# EAGLE design DUB_with_Tono(ver1.0) (EAGLE 9.6.2)
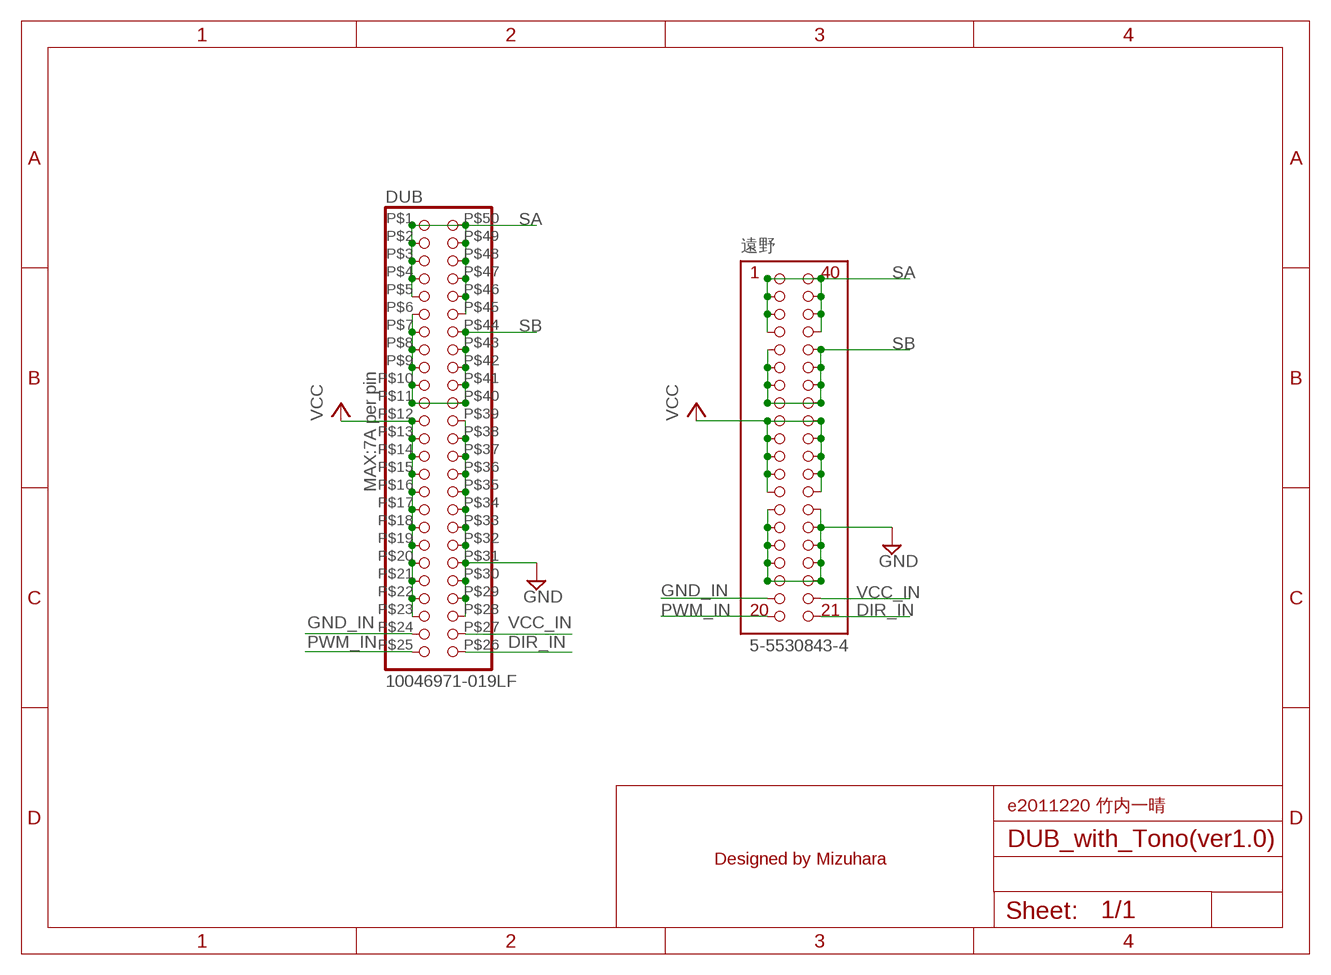
[diagram p0: schematic, sheet 1]

## Parts
DUB  10046971-019LF  [10046971-019LF]
U$1  YAJU  [TOONO]
遠野  5-5530843-4  [5-5530843-4]

## Nets
DIR_IN: DUB.P$26(P26) 遠野.P$21
GND: DUB.P$28(P28) DUB.P$29(P29) DUB.P$30(P30) DUB.P$31(P31) DUB.P$32(P32) DUB.P$33(P33) DUB.P$34(P34) DUB.P$35(P35) DUB.P$36(P36) DUB.P$37(P37) DUB.P$38(P38) DUB.P$39(P39) 遠野.P$14 遠野.P$15 遠野.P$16 遠野.P$17 遠野.P$18 遠野.P$23 遠野.P$24 遠野.P$25 遠野.P$26 遠野.P$27
GND_IN: DUB.P$24(P24) 遠野.P$19
PWM_IN: DUB.P$25(P25) 遠野.P$20
SA: DUB.P$1(P1) DUB.P$2(P2) DUB.P$3(P3) DUB.P$4(P4) DUB.P$5(P5) DUB.P$45(P45) DUB.P$46(P46) DUB.P$47(P47) DUB.P$48(P48) DUB.P$49(P49) DUB.P$50(P50) 遠野.P$1 遠野.P$2 遠野.P$3 遠野.P$4 遠野.P$37 遠野.P$38 遠野.P$39 遠野.P$40
SB: DUB.P$6(P6) DUB.P$7(P7) DUB.P$8(P8) DUB.P$9(P9) DUB.P$10(P10) DUB.P$11(P11) DUB.P$40(P40) DUB.P$41(P41) DUB.P$42(P42) DUB.P$43(P43) DUB.P$44(P44) 遠野.P$5 遠野.P$6 遠野.P$7 遠野.P$8 遠野.P$33 遠野.P$34 遠野.P$35 遠野.P$36
VCC: DUB.P$12(P12) DUB.P$13(P13) DUB.P$14(P14) DUB.P$15(P15) DUB.P$16(P16) DUB.P$17(P17) DUB.P$18(P18) DUB.P$19(P19) DUB.P$20(P20) DUB.P$21(P21) DUB.P$22(P22) DUB.P$23(P23) 遠野.P$9 遠野.P$10 遠野.P$11 遠野.P$12 遠野.P$13 遠野.P$28 遠野.P$29 遠野.P$30 遠野.P$31 遠野.P$32
VCC_IN: DUB.P$27(P27) 遠野.P$22

## Notes on the sheet
- 5-5530843-4
- e2011220 竹内一晴

## Library data of the parts
DUB = 10046971-019LF:10046971-019LF
U$1 = OKUDA_libraries:YAJU
遠野 = 5-5530843-4:5-5530843-4

## Board
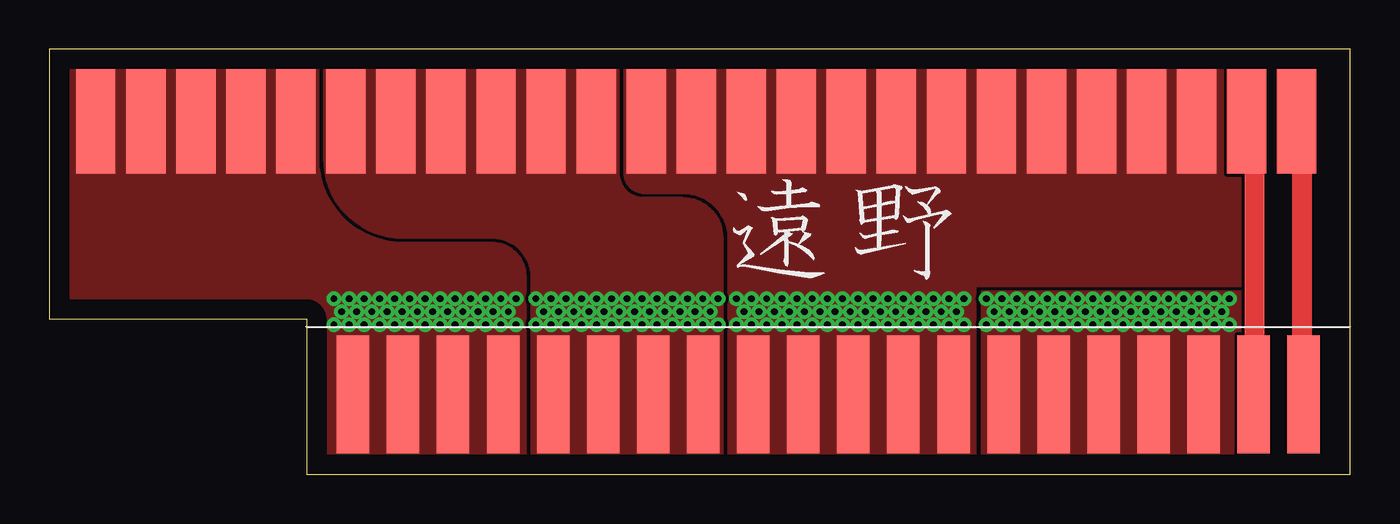
[diagram p1: board, top side]
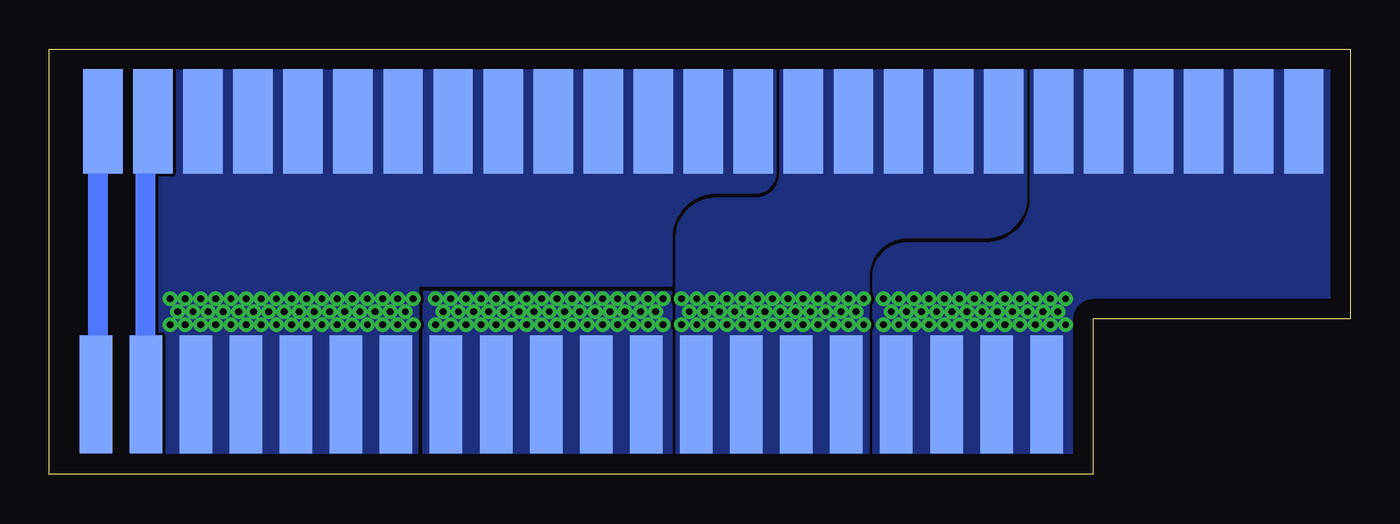
[diagram p2: board, bottom side, seen from below]

Size 66.04 x 21.59 mm. Coordinates in mm from the lower left corner, seen from the top.
Outline: 0,21.59 0,7.88 13.06,7.88 13.06,0 66.04,0 66.04,21.59 0,21.59
Copper layers (1*16): Top 0.035mm / dielectric 1.5mm / Bottom 0.035mm
Design rules "default": minimum track width 6mil, minimum drill 0.35mm, track to track 6mil, track to pad 6mil, pad to pad 6mil, via to via 6mil, smd to smd 6mil, copper to edge 40mil, drill to drill 6mil, minimum pad ring 10mil, minimum via ring 8mil, stop-mask expansion 4mil, vias tented up to drill 0mil, thermal gap 10mil

### Footprints (pad centres in the part's own frame; a part is rotated, then mirrored left to right if it is on the bottom)
10046971-019LF = smd 2 x 5.3: P$1 -30.48,0; P$2 -27.94,0; P$3 -25.4,0; P$4 -22.86,0; P$5 -20.32,0; P$6 -17.78,0; P$7 -15.24,0; P$8 -12.7,0; P$9 -10.16,0; P$10 -7.62,0; P$11 -5.08,0; P$12 -2.54,0; P$13 0,0; P$14 2.54,0; P$15 5.08,0; P$16 7.62,0; P$17 10.16,0; P$18 12.7,0; P$19 15.24,0; P$20 17.78,0; P$21 20.32,0; P$22 22.86,0; P$23 25.4,0; P$24 27.94,0; P$25 30.48,0 | smd 2 x 5.3 bottom: P$26 30.48,0; P$27 27.94,0; P$28 25.4,0; P$29 22.86,0; P$30 20.32,0; P$31 17.78,0; P$32 15.24,0; P$33 12.7,0; P$34 10.16,0; P$35 7.62,0; P$36 5.08,0; P$37 2.54,0; P$38 0,0; P$39 -2.54,0; P$40 -5.08,0; P$41 -7.62,0; P$42 -10.16,0; P$43 -12.7,0; P$44 -15.24,0; P$45 -17.78,0; P$46 -20.32,0; P$47 -22.86,0; P$48 -25.4,0; P$49 -27.94,0; P$50 -30.48,0
5-5530843-4 = smd 1.651 x 6: P$1 -25.4,0; P$2 -22.86,0; P$3 -20.32,0; P$4 -17.78,0; P$5 -15.24,0; P$6 -12.7,0; P$7 -10.16,0; P$8 -7.62,0; P$9 -5.08,0; P$10 -2.54,0; P$11 0,0; P$12 2.54,0; P$13 5.08,0; P$14 7.62,0; P$15 10.16,0; P$16 12.7,0; P$17 15.24,0; P$18 17.78,0; P$19 20.32,0; P$20 22.86,0 | smd 1.651 x 6 bottom: P$21 22.86,0; P$22 20.32,0; P$23 17.78,0; P$24 15.24,0; P$25 12.7,0; P$26 10.16,0; P$27 7.62,0; P$28 5.08,0; P$29 2.54,0; P$30 0,0; P$31 -2.54,0; P$32 -5.08,0; P$33 -7.62,0; P$34 -10.16,0; P$35 -12.7,0; P$36 -15.24,0; P$37 -17.78,0; P$38 -20.32,0; P$39 -22.86,0; P$40 -25.4,0

### Placement (x,y rotation side)
DUB  32.84,17.92 0 top
U$1  33.88,9.24 0 top
遠野  40.82,4.06 0 top

### Tracks (layer width: path | path; a pad name or v marks a point on that pad's centre or on a via)
DIR_IN
  Bottom 0.508: 遠野.P$21 63.68,4.15 63.58,4.25
  Bottom 1.016: DUB.P$26 63.58,17.66 63.58,4.25
GND  (via drill 0.35)
  other vias: 47.58,7.6 47.97,8.26 47.58,8.92 48.35,7.6 49.12,7.6 49.89,7.6 50.66,7.6 51.43,7.6 52.2,7.6 52.97,7.6 53.74,7.6 54.51,7.6 55.28,7.6 56.05,7.6 56.82,7.6 48.73,8.26 49.51,8.26 50.27,8.26 51.05,8.26 51.81,8.26 52.59,8.26 53.35,8.26 54.12,8.26 54.9,8.26 55.66,8.26 56.44,8.26 48.35,8.92 49.12,8.92 49.89,8.92 50.66,8.92 51.43,8.92 52.2,8.92 52.97,8.92 53.74,8.92 54.51,8.92 55.28,8.92 56.05,8.92 56.82,8.92 57.2,8.26 57.59,7.6 57.59,8.92 57.98,8.26 58.36,7.6 59.13,7.6 58.74,8.26 58.36,8.92 59.13,8.92 59.9,7.6 59.52,8.26 59.9,8.92
  pour Top (no thermals): 47.33,9.27 47.33,-2.02 67.03,-2.02 67.03,9.27
  pour Bottom (no thermals): 29.21,24 29.21,15.31 arc90 30.21,14.31 32.18,14.31 arc-90 34.48,12.01 34.48,9.58 47.33,9.58 47.41,-2 69.71,-2 69.71,24
GND_IN
  Top 1.016: DUB.P$24 61.16,17.54 61.16,4.08 遠野.P$19
PWM_IN
  Top 1.016: DUB.P$25 63.58,17.66 63.58,4.16 遠野.P$20
SA  (via drill 0.35)
  other vias: 14.45,7.6 14.84,8.26 14.45,8.92 15.22,7.6 15.99,7.6 16.76,7.6 17.53,7.6 18.3,7.6 19.07,7.6 19.84,7.6 20.61,7.6 21.38,7.6 22.15,7.6 22.92,7.6 23.69,7.6 15.61,8.26 16.38,8.26 17.14,8.26 17.91,8.26 18.68,8.26 19.45,8.26 20.23,8.26 21,8.26 21.77,8.26 22.54,8.26 23.3,8.26 15.22,8.92 15.99,8.92 16.76,8.92 17.53,8.92 18.3,8.92 19.07,8.92 19.84,8.92 20.61,8.92 21.38,8.92 22.15,8.92 22.92,8.92 23.69,8.92
  pour Bottom (no thermals): -2,24 -2,-2 24.17,-2 24.17,10.03 arc90 22.47,11.73 18.48,11.73 arc-90 16.18,14.03 16.18,24
  pour Top (no thermals): -0.12,21.7 -0.12,6.96 12.95,6.96 12.96,6.95 12.96,-0.36 12.93,-0.39 24.12,-0.39 24.17,-0.44 24.17,10.03 arc90 22.47,11.73 17.94,11.73 arc-90 13.64,16.03 13.64,21.81
SB  (via drill 0.35)
  other vias: 24.7,7.6 25.09,8.26 24.7,8.92 25.47,7.6 26.24,7.6 27.01,7.6 27.78,7.6 28.55,7.6 29.32,7.6 30.09,7.6 30.86,7.6 31.63,7.6 32.4,7.6 33.17,7.6 33.94,7.6 25.86,8.26 26.62,8.26 27.39,8.26 28.16,8.26 28.93,8.26 29.7,8.26 30.48,8.26 31.25,8.26 32.02,8.26 32.78,8.26 33.55,8.26 25.47,8.92 26.24,8.92 27.01,8.92 27.78,8.92 28.55,8.92 29.32,8.92 30.09,8.92 30.86,8.92 31.63,8.92 32.4,8.92 33.17,8.92 33.94,8.92
  pour Top (no thermals): 13.95,24 13.95,16.04 arc90 17.95,12.04 22.48,12.04 arc-90 24.48,10.04 24.48,-2 34.17,-2 34.17,12 arc90 32.17,14 30.2,14 arc-90 28.9,15.3 28.9,24
  pour Bottom (no thermals): 16.49,24 16.49,14.04 arc90 18.49,12.04 22.48,12.04 arc-90 24.48,10.04 24.48,-1.3 34.17,-1.3 34.17,12 arc90 32.17,14 30.2,14 arc-90 28.9,15.3 28.9,24
VCC  (via drill 0.35)
  other vias: 34.88,7.6 35.27,8.26 34.88,8.92 35.65,7.6 36.42,7.6 37.19,7.6 37.96,7.6 38.73,7.6 39.5,7.6 40.27,7.6 41.04,7.6 41.81,7.6 42.58,7.6 43.35,7.6 44.12,7.6 36.03,8.26 36.8,8.26 37.58,8.26 38.34,8.26 39.12,8.26 39.88,8.26 40.66,8.26 41.42,8.26 42.2,8.26 42.97,8.26 43.73,8.26 35.65,8.92 36.42,8.92 37.19,8.92 37.96,8.92 38.73,8.92 39.5,8.92 40.27,8.92 41.04,8.92 41.81,8.92 42.58,8.92 43.35,8.92 44.12,8.92 44.51,8.26 44.89,7.6 44.89,8.92 45.27,8.26 45.66,7.6 46.43,7.6 46.05,8.26 45.66,8.92 46.43,8.92
  pour Bottom (no thermals): 34.48,9.27 34.48,-2 47,-2 47,9.27
  pour Top (no thermals): 29.21,24 29.21,15.31 arc90 30.21,14.31 32.18,14.31 arc-90 34.48,12.01 34.48,-2 47,-2 47,9.58 67.06,9.58 67.06,24
VCC_IN
  Bottom 1.016: DUB.P$27 61.16,17.54 61.16,4.09 遠野.P$22